# Altium project RF_V3.PrjPcb
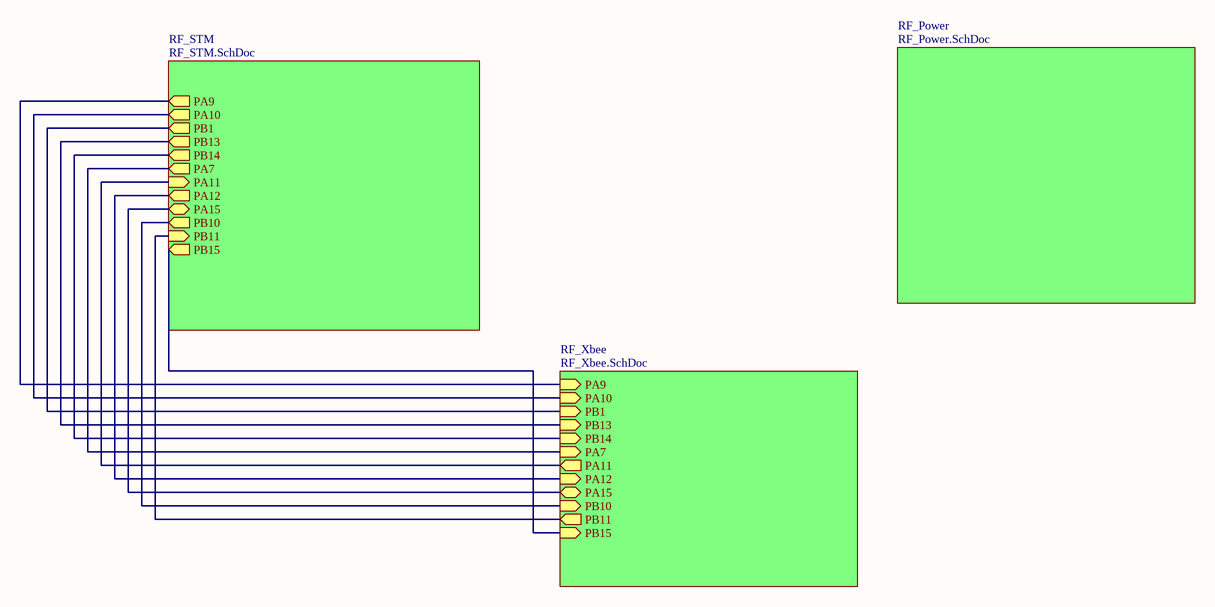
[diagram p0: RF_SCH.SchDoc]
4 sheets, 65 parts. Net scope: hierarchical (ports join the sheet entries above them; power ports are global).
Board files: RF_PCB-v2.PcbDoc, RF_PCB-v1.PcbDoc, RF_PCB.PcbDoc, RF_PCB1.PcbDoc
Sheets:
  RF_SCH.SchDoc
    RF_STM = RF_STM.SchDoc
    RF_Power = RF_Power.SchDoc
    RF_Xbee = RF_Xbee.SchDoc

## Sheet RF_SCH.SchDoc
size A4

### Sub-sheets
RF_Power = RF_Power.SchDoc: no entries
RF_STM = RF_STM.SchDoc: PA9 (out), PA10 (out), PB1 (out), PB13 (out), PB14 (out), PA7 (out), PA11 (in), PA12 (out), PA15 (bidir), PB10 (out), PB11 (in), PB15 (out)
RF_Xbee = RF_Xbee.SchDoc: PA9 (in), PA10 (in), PB1 (in), PB13 (in), PB14 (in), PA7 (in), PA11 (out), PA12 (in), PA15 (bidir), PB10 (in), PB11 (out), PB15 (in)

### Nets
Net1_3: sheet RF_STM/PA10, sheet RF_Xbee/PA10
Net1_4: sheet RF_STM/PA9, sheet RF_Xbee/PA9
Net1_6: sheet RF_STM/PB15, sheet RF_Xbee/PB15
Net1_7: sheet RF_STM/PB1, sheet RF_Xbee/PB1
Net1_10: sheet RF_STM/PB13, sheet RF_Xbee/PB13
Net1_29: sheet RF_STM/PB14, sheet RF_Xbee/PB14
NetC12_2: sheet RF_STM/PA7, sheet RF_Xbee/PA7
NetU3_29: sheet RF_STM/PB10, sheet RF_Xbee/PB10
NetU3_30: sheet RF_STM/PB11, sheet RF_Xbee/PB11
NetU3_44: sheet RF_STM/PA11, sheet RF_Xbee/PA11
NetU3_45: sheet RF_STM/PA12, sheet RF_Xbee/PA12
NetU3_50: sheet RF_STM/PA15, sheet RF_Xbee/PA15

## Sheet RF_STM.SchDoc
size A4
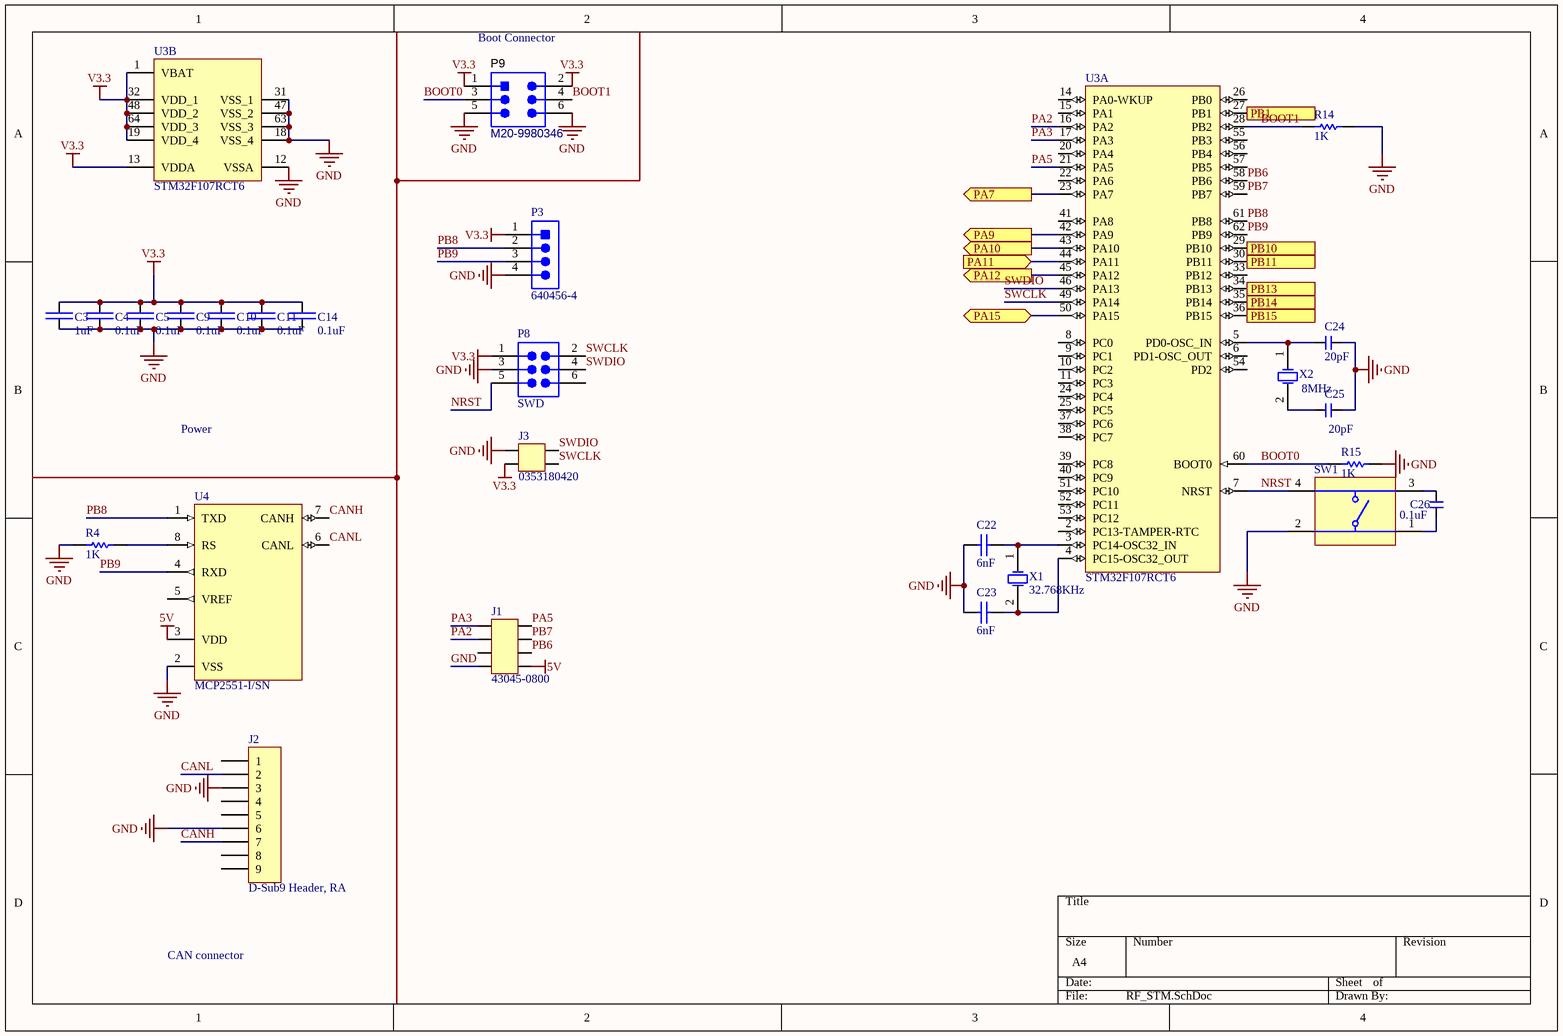
[diagram p1: RF_STM.SchDoc]

### Parts
C3  1uF  [C0805]
C4  0.1uF  [C0805]
C5  0.1uF  [C0805]
C9  0.1uF  [C0805]
C10  0.1uF  [C0805]
C11  0.1uF  [C0805]
C14  0.1uF  [C0805]
C22  6nF  [CAPC2013X140X50LL20T25]
C23  6nF  [CAPC2013X140X50LL20T25]
C24  20pF  [C0805]
C25  20pF  [C0805]
C26  0.1uF  [C0805]
J1  43045-0800  [Micro-Fit 3.0 8pos]
J2  D-Sub9 Header, RA  [D9 Connector]
J3  0353180420  [Mini-fit Jr. 4pos]
P3  640456-4  [TECO-640456-4]
P8  SWD  [SMTC-TSW-103-08-X-D]
P9  M20-9980346  [HRWN-M20-9980346_V]
R4  1K  [RESC1608X55X25ML10T15]
R14  1K  [RESC2013X50X30NL20T20]
R15  1K  [RESC2013X50X30NL20T20]
SW1  PTS645SM43SMTR92LFS  [ITT-PTS645S-4_V]  (value not drawn)
U3  STM32F107RCT6  [STM-LQFP64_M]  (parts A,B of 2)
U4  MCP2551-I/SN  [SOIC-SN8_N]
X1  32.768KHz  [ABRA-ABS07-2_V]
X2  8MHz  [ABRA-ABM3-2_V]

### Ports
PA7 (out), PA9 (out), PA10 (out), PA11 (in), PA12 (out), PA15 (bidir), PB1 (out), PB10 (out), PB11 (in), PB13 (out), PB14 (out), PB15 (out)

### Nets
5V: J1.4 U4.3(VDD)
GND: C3.2 C4.1 C5.1 C9.1 C10.2 C11.1 C14.1 C22.1 C23.1 C24.1 C25.1 J1.8 J2.3 J2.6 J3.1 P3.4 P8.3 P9.5 P9.6 R4.1 R14.1 R15.1 SW1.2 U3.12(VSSA) U3.18(VSS_4) U3.31(VSS_1) U3.47(VSS_2) U3.63(VSS_3) U4.2(VSS)
V3.3: C3.1 C4.2 C5.2 C9.2 C10.1 C11.2 C14.2 J3.3 P3.1 P8.1 P9.1 P9.2 U3.1(VBAT) U3.13(VDDA) U3.19(VDD_4) U3.32(VDD_1) U3.48(VDD_2) U3.64(VDD_3)
BOOT0: P9.3 R15.2 U3.60(BOOT0)
BOOT1: P9.4 R14.2 U3.28(PB2)
CANH: J2.7 U4.7(CANH)
CANL: J2.2 U4.6(CANL)
NRST: P8.5 SW1.4 U3.7(NRST)
PA2: J1.6 U3.16(PA2)
PA3: J1.5 U3.17(PA3)
PA5: J1.1 U3.21(PA5)
PB6: J1.3 U3.58(PB6)
PB7: J1.2 U3.59(PB7)
PB8: P3.2 U3.61(PB8) U4.1(TXD)
PB9: P3.3 U3.62(PB9) U4.4(RXD)
SWCLK: J3.4 P8.2 U3.49(PA14)
SWDIO: J3.2 P8.4 U3.46(PA13)
Net1_3: U3.43(PA10) ; port PA10
Net1_4: U3.42(PA9) ; port PA9
Net1_6: U3.36(PB15) ; port PB15
Net1_7: U3.27(PB1) ; port PB1
Net1_10: U3.34(PB13) ; port PB13
Net1_29: U3.35(PB14) ; port PB14
NetC12_2: U3.23(PA7) ; port PA7
NetC22_2: C22.2 U3.3(PC14-OSC32_IN) X1.1(X1)
NetC23_2: C23.2 U3.4(PC15-OSC32_OUT) X1.2(X2)
NetC24_2: C24.2 U3.5(PD0-OSC_IN) X2.1(X1)
NetC25_2: C25.2 X2.2(X2)
NetC26_1: C26.1 SW1.3
NetC26_2: C26.2 SW1.1
NetR4_2: R4.2 U4.8(RS)
NetU3_29: U3.29(PB10) ; port PB10
NetU3_30: U3.30(PB11) ; port PB11
NetU3_44: U3.44(PA11) ; port PA11
NetU3_45: U3.45(PA12) ; port PA12
NetU3_50: U3.50(PA15) ; port PA15

Not connected (* = marked no-connect by the designer): J1 7; J2 1 4 5 8 9; P8 6; U3 2(PC13-TAMPER-RTC) 6(PD1-OSC_OUT) 8(PC0) 9(PC1) 10(PC2) 11(PC3) 14(PA0-WKUP) 15(PA1) 20(PA4) 22(PA6) 24(PC4) 25(PC5) 26(PB0) 33(PB12) 37(PC6) 38(PC7) 39(PC8) 40(PC9) 41(PA8) 51(PC10) 52(PC11) 53(PC12) 54(PD2) 55(PB3) 56(PB4) 57(PB5); U4 5(VREF)

### Notes on the sheet
- (near P9) Boot Connector
- Power
- CAN connector

### Library data of the parts
C3 = CL21B105KAFNNNE: Cap Ceramic 1uF 25V X7R 10% SMD 0805 125C T/R; Manufacturer: Samsung; Supplier 1: Digi-Key; Supplier Part Number 1: 1276-1066-1-ND; Manufacturer Part Number: CL21B105KAFNNNE; Stock 1: 1606570; Pricing 1: 1 = 0.10000, 10 = 0.07600, 100 = 0.03380, 500 = 0.02416, 1000 = 0.01898 (USD); RoHS: Yes; Mount: Surface Mount; Case/Package: 0805; Contact Plating: Tin; Case Code (Metric): 2012; Case Code (Imperial): 0805; Min Operating Temperature: -55°C; Max Operating Temperature: 125°C; Packaging: Tape and Reel; Package Quantity: 1; Capacitance: 1uF; Tolerance: 10%; Voltage Rating: 25V; Dielectric: X7R; Voltage: 25V; Voltage Rating (DC): 25V; Length: 2mm; Height: 1.25mm; Depth: 1.25mm; Width: 0.049inch; Thickness: 0.053inch; Radiation Hardening: No; Lead Free: Lead Free; ComponentLink1URL: https://datasheet.ciiva.com/25800/cl21b105kafnnne-25800163.pdf?src-supplier=Digi-Key; ComponentLink1Description: https://datasheet.ciiva.com/25800/cl21b105kafnnne-25800163.pdf?src-supplier=Digi-Key; ComponentLink2URL: https://datasheet.ciiva.com/15195/getdatasheetpartid-355205-15195880.pdf?src-supplier=Verical; ComponentLink2Description: https://datasheet.ciiva.com/15195/getdatasheetpartid-355205-15195880.pdf?src-supplier=Verical; Category: Capacitors
C4 C5 C9-C11 C14 C26 = CL21B104KBCWPNC: CAP CER 0.1UF 50V X7R 0805; Manufacturer: Samsung; Capacitance: 100nF; Tolerance: 10%; Supplier 1: Digi-Key; Supplier Part Number 1: 1276-6557-1-ND; Manufacturer Part Number: CL21B104KBCWPNC; Stock 1: 6545; Pricing 1: 1 = 0.10000, 10 = 0.06700, 100 = 0.02990, 500 = 0.02138, 1000 = 0.01680 (USD); RoHS: Yes; Mount: Surface Mount; Case/Package: 0805; Case Code (Metric): 2012; Case Code (Imperial): 0805; Min Operating Temperature: -55°C; Max Operating Temperature: 125°C; Packaging: Tape and Reel; Voltage Rating: 50V; Features: Soft Termination; Length: 0.079inch; Width: 0.049inch; Thickness: 0.053inch; Ratings: AEC-Q200; Category: Capacitors
C22 C23 = CMP-2000-05810-1: Chip Capacitor, 2.2 uF, +/- 10%, 10 V, -55 to 85 degC, 0805 (2012 Metric), RoHS, Tape and Reel; Manufacturer: AVX; Dielectric: X5R; Rated Voltage: 10V; Capacitance: 2.2µF; Tolerance (%): ±10%; Datasheet Version: 05/2016; Manufacturer URL: http://www.avx.com/; Package Description: 2-Pin Surface Mount Device, Body 2.01 x 1.25 mm; Mounting Technology: SurfaceMount; Case Size/Dimension: 0805; Package Reference: 0805; Datasheet URL: http://datasheets.avx.com/cx5r.pdf
C24 C25 = C0805C200J5GACTU: CAP CER 20PF 50V C0G/NP0 0805; Manufacturer: Samsung; Manufacturer Part Number: CL21B103KBANNNC; Material: Ceramic; Capacitance: 10nF; Tolerance: 10%; Dielectric: X7R; Supplier 1: Digi-Key; Supplier Part Number 1: 399-8033-1-ND; RoHS: Yes; Mount: Surface Mount; Case/Package: 0805; Case Code (Metric): 2012; Case Code (Imperial): 0805; Contact Plating: Tin; Min Operating Temperature: -55°C; Max Operating Temperature: 125°C; Packaging: Tape and Reel; Voltage Rating: 50V; Voltage: 50V; Voltage Rating (DC): 50V; Length: 2mm; Height: 0.65mm; Width: 0.049inch; Thickness: 0.03inch; Depth: 1.25mm; Radiation Hardening: No; Lead Free: Lead Free; Category: Capacitors; ComponentLink1Description: https://www.digikey.com/product-detail/en/kemet/C0805C200J5GACTU/399-8033-1-ND/3471756; ComponentLink1URL: https://www.digikey.com/product-detail/en/kemet/C0805C200J5GACTU/399-8033-1-ND/3471756
J1 = 43045-0800: Micro-fit 3.0 8pos right-angle; Manufacturer: Molex; Number of Positions: 8; Contact Resistance: 10mR; Gender: Male; Working Voltage: 250V; Max Voltage Rating (DC): 250.25kV; Current Rating: 5A; Voltage Rating: 600V; Insulation Resistance: 1GR; Pitch: 3mm; Approvals: UL,CSA,TUV; Glow Wire Compliant: Compliant; Supplier 1: Digi-Key; Supplier Part Number 1: WM1816-ND; Manufacturer Part Number: 43045-0800; RoHS: Yes; Category: Headers and Wire Housings; Stock 1: 7880; Mount: Through Hole; Case/Package: SMC; Housing Color: Black; Housing Material: Thermoplastic; Contact Plating: Tin; Contact Material: Brass,Tin; Color: Black; Material: Polyester; Min Operating Temperature: -40°C; Max Operating Temperature: 105°C; Termination: Solder; Number of Contacts: 8; Orientation: Right Angle; Number of Rows: 2; Packaging: Tray; Number of Circuits: 8; Number of Poles: 8; Voltage Rating (AC): 250V; Package Quantity: 1440; Max Current Rating: 5A; Voltage Rating (DC): 250V; Diameter: 3mm; Length: 16.15mm; Height: 8.77mm; Row Spacing: 3mm; Depth: 12.2mm; Radiation Hardening: No; Flammability Rating: UL94 V-0; REACH SVHC: Unknown; Halogen Free: Low Halogen; Lead Free: Lead Free; ComponentLink1URL: https://datasheet.ciiva.com/5158/0430450800-pcb-headers-142625-5158817.pdf?src-supplier=Mouser; ComponentLink1Description: https://datasheet.ciiva.com/5158/0430450800-pcb-headers-142625-5158817.pdf?src-supplier=Mouser; ComponentLink2URL: https://datasheet.ciiva.com/7683/27645-7683683.pdf?src-supplier=Element14; ComponentLink2Description: https://datasheet.ciiva.com/7683/27645-7683683.pdf?src-supplier=Element14; ComponentLink3URL: https://datasheet.ciiva.com/11751/0900766b80027348-11751142.pdf?src-supplier=RSComponents; ComponentLink3Description: https://datasheet.ciiva.com/11751/0900766b80027348-11751142.pdf?src-supplier=RSComponents; ComponentLink4URL: https://datasheet.ciiva.com/30198/267770430450800-pcb-headers-30198875.pdf?src-supplier=Onlinecomponents.com; ComponentLink4Description: https://datasheet.ciiva.com/30198/267770430450800-pcb-headers-30198875.pdf?src-supplier=Onlinecomponents.com; ComponentLink5URL: https://datasheet.ciiva.com/19462/883536-19462164.pdf?src-supplier=Jameco; ComponentLink5Description: https://datasheet.ciiva.com/19462/883536-19462164.pdf?src-supplier=Jameco; ComponentLink6URL: https://datasheet.ciiva.com/14155/04402310-14155206.pdf?src-supplier=Distrelec; ComponentLink6Description: https://datasheet.ciiva.com/14155/04402310-14155206.pdf?src-supplier=Distrelec; ComponentLink7URL: https://datasheet.ciiva.com/16657/0430450800-pcb-headers-16657964.pdf?src-supplier=Avnet+Europe; ComponentLink7Description: https://datasheet.ciiva.com/16657/0430450800-pcb-headers-16657964.pdf?src-supplier=Avnet+Europe; ComponentLink8URL: https://datasheet.ciiva.com/10087/0430450800-pcb-headers-10087853.pdf?src-supplier=Avnet; ComponentLink8Description: https://datasheet.ciiva.com/10087/0430450800-pcb-headers-10087853.pdf?src-supplier=Avnet; ComponentLink9URL: https://datasheet.ciiva.com/1443/1850016-1443537.pdf?src-supplier=Element14; ComponentLink9Description: https://datasheet.ciiva.com/1443/1850016-1443537.pdf?src-supplier=Element14
J2 = 5747840-6: CONN D-SUB PLUG 9POS R/A SOLDER; Manufacturer: TE Connectivity; Body Material: Metal; Body Plating: Tin; Voltage Rating: 125V; Current Rating: 6A; Gender: Male; Number of Positions: 9; Number of Ports: 1; Mating Connector Lock: Yes (With); PCB Mount Retention: With; PCB Mounting Orientation: Right Angle; Preloaded: Yes; Sealable: No (Without); Pitch: 2.74mm; PCB Thickness: 1.57mm; Contact Post Length: 3.17mm; Hole Diameter: 0.125inch; Approvals: CSA,UL; Supplier 1: Digi-Key; Supplier Part Number 1: A32094-ND; Manufacturer Part Number: 5747840-6; Stock 1: 2830; Pricing 1: 1 = 4.13000, 10 = 3.96400, 25 = 3.63360, 50 = 3.46860, 130 = 3.30338, 260 = 2.89046, 520 = 2.80788, 1040 = 2.39496, 2600 = 2.22980 (USD); RoHS: Yes; Mount: Through Hole; Case/Package: Metal; Contact Material: Brass; Contact Plating: Gold,Nickel,Tin; Color: Black; Number of Terminals: 9; Material: Metal; Plating: Tin; Housing Material: Nylon; Contact Shape: Round; Housing Color: Black; Shell Material: Steel; Min Operating Temperature: -55°C; Max Operating Temperature: 105°C; Number of Rows: 2; Packaging: Tray; Package Quantity: 130; Connector Type: Plug; Termination: Solder; Number of Contacts: 9; Orientation: Right Angle; Mating Retention: Yes (With); PCB Mount Alignment: Yes (With); Length: 30.81mm; Height: 12.55mm; Width: 12.55mm; Depth: 18.62mm; Radiation Hardening: No; REACH SVHC: No SVHC; Flammability Rating: UL94 V-0; ComponentLink1URL: https://www.verical.com/server-webapp/html/getDatasheet?partID=46840&src-supplier=Verical; ComponentLink1Description: https://www.verical.com/server-webapp/html/getDatasheet?partID=46840&src-supplier=Verical; ComponentLink2URL: https://www.te.com/commerce/DocumentDelivery/DDEController?Action=srchrtrv&DocNm=82068_AMPLIMITE_Right-Angle_Posted_Conn&DocType=CS&DocLang=English&src-supplier=Digi-Key; ComponentLink2Description: https://www.te.com/commerce/DocumentDelivery/DDEController?Action=srchrtrv&DocNm=82068_AMPLIMITE_Right-Angle_Posted_Conn&DocType=CS&DocLang=English&src-supplier=Digi-Key; ComponentLink3URL: http://www.jameco.com/Jameco/Products/ProdDS/853231.pdf?src-supplier=Jameco; ComponentLink3Description: http://www.jameco.com/Jameco/Products/ProdDS/853231.pdf?src-supplier=Jameco; ComponentLink4URL: http://www.te.com/commerce/DocumentDelivery/DDEController?Action=srchrtrv&DocNm=82068_AMPLIMITE_Right-Angle_Posted_Conn&DocType=Catalog+Section&DocLang=English&src-supplier=Avnet+Europe; ComponentLink4Description: http://www.te.com/commerce/DocumentDelivery/DDEController?Action=srchrtrv&DocNm=82068_AMPLIMITE_Right-Angle_Posted_Conn&DocType=Catalog+Section&DocLang=English&src-supplier=Avnet+Europe; ComponentLink5URL: http://www.te.com/commerce/DocumentDelivery/DDEController?Action=srchrtrv&DocNm=82068_AMPLIMITE_Right-Angle_Posted_Conn&DocType=Catalog+Section&DocLang=English&src-supplier=Avnet; ComponentLink5Description: http://www.te.com/commerce/DocumentDelivery/DDEController?Action=srchrtrv&DocNm=82068_AMPLIMITE_Right-Angle_Posted_Conn&DocType=Catalog+Section&DocLang=English&src-supplier=Avnet; ComponentLink6URL: http://www.te.com/commerce/DocumentDelivery/DDEController?Action=srchrtrv&DocNm=82068_AMPLIMITE_Right-Angle_Posted_Conn&DocType=Catalog+Section&DocLang=English&PartCntxt=&src-supplier=Element14; ComponentLink6Description: http://www.te.com/commerce/DocumentDelivery/DDEController?Action=srchrtrv&DocNm=82068_AMPLIMITE_Right-Angle_Posted_Conn&DocType=Catalog+Section&DocLang=English&PartCntxt=&src-supplier=Element14; Category: Connectors
J3 = 0353180420: Conn Power HDR 4 POS 4.2mm Solder RA Thru-Hole 4 Terminal 1 Port Mini-Fit® Bag; Manufacturer: Molex; Number of Positions: 4; Number of Ports: 1; Connector Type: Male Pin; Row Spacing: 0.165inch; Supplier 1: Digi-Key; Supplier Part Number 1: WM13195-ND; Manufacturer Part Number: 0353180420; RoHS: Yes; Category: Headers and Wire Housings; Stock 1: 17776; Mount: Through Hole; Contact Material: Brass; Contact Plating: Tin; Housing Material: Nylon; Color: Natural; Number of Terminals: 4; Min Operating Temperature: -40°C; Max Operating Temperature: 105°C; Orientation: Right Angle; Number of Rows: 2; Packaging: Bulk; Termination: Solder; Number of Contacts: 4; Package Quantity: 5000; Fastening Type: Ramp; Length: 9.6mm; Pitch: 4.2mm; Contact Mating Length: 0.208inch; Depth: 12.8mm; ComponentLink1URL: https://datasheet.ciiva.com/6840/353180820-sd-6840231.pdf?src-supplier=Digi-Key; ComponentLink1Description: https://datasheet.ciiva.com/6840/353180820-sd-6840231.pdf?src-supplier=Digi-Key
P3 = CMP-2000-05419-1: Male Header, Pitch 2.54 mm, 1 x 4 Position, Height 10.03 mm, Tail Length 3.56 mm, RoHS, Bulk; Manufacturer: TE Connectivity; Material, Housing: Polyester; Primary Type: InterconnectSystem; Mount Angle: Vertical; Color, Housing: White; Current, Rating: 5 / A; Agency Approvals: CSA,UL; Contact Termination Area Plating: Tin; Temperature, Operating: -55to+105 / degC; Standards: RoHSCompliant,ELVCompliant,UL94V-0; Number of Positions: 4; Brand/Series: MTA-100Series; Angle: Straight; Pin Spacing: 0.1 / "; Material, Contact: CopperAlloy; Connector Type: MTA-100; Special Features: Pinstrip; Mounting Hole Size: 0.04 / "; Contact Centerline Spacing: 0.100 / in.; Voltage, Rating: 250 / V; Manufacturer URL: http://www.te.com/; Length, Pin: 0.14 / "; Length, Overall: 0.4 / "; Color: White; Flammability Rating: UL94V-0; Mounting Type: PCMount; Termination: Solder; Datasheet URL: https://datasheet.ciiva.com/16286/eng-ds-82056-mta-0608-16286228.pdf; Number of Contacts: 4; Contact Shape: Square; Contact Mating Area Plating: Tin; Length, Terminal Post: 0.14 / in.; Size, Post: 0.025 / in.; Contact Plating: Tin; Type: PCBPlug; Datasheet Version: Dec-14; Number of Rows: 1
P8 = CMP-1024-00338-1: 0.025" SQ Post Header, Through-hole, Vertical, -55 to 125 degC, 2.54 mm Pitch, 6-Pin, Male, RoHS; Manufacturer: Samtec; PartNumber: TSW-103-08-G-D; Pitch: 2.54 mm; ComponentLink1URL: http://www.samtec.com; ComponentLink2URL: http://www.samtec.com/documents/webfiles/pdf/TSW_TH.PDF; Temperature Range: -55 to 125 degC; RoHS: True; ComponentLink2Description: Datasheet; PackageReference: TSW-103-08-X-D; ComponentLink3Description: Package Specification; PackageDescription: .025[0.64] SQ. Post Terminal Strip Assembly; DatasheetVersion: F-214; Mounting Technology: Through-hole; ComponentLink1Description: Manufacturer URL; Orientation: Vertical; PackageVersion: DM, 8/1988; ComponentLink3URL: http://www.samtec.com/documents/webfiles/cpdf/TSW-XXX-XX-XXX-X-XX-XXX-MKT.pdf
P9 = CMP-2000-06636-1: Male Header, Pitch 2.54 mm, 2 x 3 Position, Height 8.64 mm, Tail Length 3 mm, -40 to 105 degC, RoHS, Bulk; Manufacturer: Harwin-Inc.; Row Spacing: 0.100"(2.54mm); Connector Type: Header,Unshrouded,Breakaway; Number of Positions Loaded: All; Number of Positions: 6; Datasheet Version: 12/2006; Mounting Technology: ThroughHole; Mounting Type: ThroughHole; Fastening Type: -; Contact Finish Thickness: -; Features: -; Series: M20; Package Reference: M20-9980346; Pitch: 0.100"(2.54mm); Contact Mating Length: 0.240"(6.10mm); Manufacturer URL: https://www.harwin.com/; Datasheet URL: https://datasheet.ciiva.com/26899/getdatasheetpartid-483857-26899433.pdf; Number of Rows: 2; Contact Type: MalePin; Termination: Solder; Contact Finish: Tin; Family: RectangularConnectors-Headers,MalePins; Color: Black; Package Description: Male Header, Pitch 2.54 mm, 2 x 3 Position, Height 8.64 mm, Tail Length 3 mm; Packaging: Bulk; Category: Connectors,Interconnects
R4 = CMP-2100-03664-1: Chip Resistor, 10 KOhm, +/- 1%, 01 W, -55 to 155 degC, 0603 (1608 Metric), RoHS, Tape and Reel; Manufacturer: Yageo; Temperature Coefficient: 100ppm/degreesC; Resistance: 10KOhm; Voltage Rating: 75V; Power Rating: 100mW; Voltage Rating (DC): 50V; Composition: ThickFilm; RoHSCompliant: true; Height: 0.45mm; Lead Free: LeadFree; Case Code (Metric): 1608; Case/Package: 0603; Datasheet Version: Rev. 5, 10/2016; Package Reference: 0603; Depth: 0.8mm; Package Description: 2-Pin Surface Mount Device, Body 1.6 x 0.8 mm; Case Code (Imperial): 0603; Packaging: TapeandReel; Termination: SMD/SMT; Lead Pitch: 0.3mm; Width: 0.8mm; Number of Pins: 2; Length: 1.6mm; REACH SVHC: NoSVHC; Military Standard: Not; Max Operating Temperature: 155degC; Min Operating Temperature: -55degC; Manufacturer URL: http://www.yageo.com/; Datasheet URL: http://www.yageo.com/NewPortal/yageodocoutput?fileName=/pdf/R-Chip/PYu-RC_Group_51_RoHS_L_5.pdf; Weight: 7.1E-05oz; Tolerance: 1%
R14 R15 = CMP-2001-03595-1: Part Number: CRCW08051K00FKEA; Manufacturer: Vishay Dale
SW1 = CMP-2000-05160-1: 6 mm Tact Switche, SPST, NO, -20 to 60 degC, 4-Pin SMT, RoHS, Tape and Reel; Manufacturer: ITT Cannon; Manufacturer URL: http://www.ittcannon.com/; Datasheet Version: Feb-14; Datasheet URL: https://datasheet.ciiva.com/29903/getdatasheetpartid-786341-29903846.pdf
U3 = CMP-0237-00079-3: ARM Cortex-M3 32-bit MCU, 256 KB Flash, 64 KB Internal RAM, 51 I/Os, 64-pin LQFP, -40 to 85 degC, Tray; FLASH Size (Prog) (kB): 256; Operating Frequency(F) (Processor speed) (MHz): 72; Supply Voltage(Vcc) min (V): 2; Internal RAM Size (kB): 64; A/D Converter: 2x12-bit (16 Channel); I/Os (High Current): 51; D/A Converter: 2x12-bit (2 Channel); Mounting Technology: Surface Mount; PartNumber: STM32F107RCT6; ComponentLink3URL: http://www.st.com/st-web-ui/static/active/en/resource/technical/document/datasheet/DM00037051.pdf; Packing: Tray; ComponentLink1URL: http://www.st.com/web/en/home.html; Core: ARM Cortex-M3; ComponentLink1Description: Manufacturer URL; ComponentLink2URL: http://www.st.com/st-web-ui/static/active/en/resource/technical/document/datasheet/CD00220364.pdf; DatasheetVersion: Rev. 6; PackageDescription: 64-Pin Low Profile Quad Flat Package, 10 x 10 mm Body, 0.5 mm Pitch; PackageVersion: Rev. 4, 06/2013; ComponentLink2Description: Datasheet; ComponentLink3Description: Package Specification; PackageReference: LQFP64
U4 = CMP-0186-00138-2: High-Speed CAN Transceiver, 8-Pin SOIC, Industrial Temperature; Code_JEDEC: MS-012; ComponentLink3URL: http://www.microchip.com/stellent/groups/techpub_sg/documents/packagingspec/en012702.pdf; DatasheetVersion: revF, Jul-2010; PackageVersion: revBB, Aug-2009; PackageDescription: 8-Lead Plastic Small Outline (SN) - Narrow, 3.90mm Body [SOIC]; ComponentLink1URL: http://www.microchip.com/; ComponentLink3Description: Package Specification; ComponentLink2Description: Datasheet; Code_IPC: SOIC127P600-8; ComponentLink1Description: Manufacturer URL; PackageReference: SOIC-SN8; ComponentLink2URL: http://ww1.microchip.com/downloads/en/DeviceDoc/21667F.pdf; RevisionNote: URLs added. DatasheetVersion updated.
X1 = CMP-0447-00001-2: Crystal, 32.768 kHz, 12.5 pF, -40 to 85 degC, SMD Low Profile 3.2 x 1.5 x 0.9 mm, Tape and Reel; Manufacturer: Abracon; PartNumber: ABS07-32.768KHz-T; Q Value (Type): 30000; Operation Mode: Flexural Mode (Tuning Fork); Shunt Capacitance (C0): 0.9 to 1.2 pF; Load Capacitance (CL): 12.5 pF; Frequency Tolerance @+25degC: +/- 20 ppm; Drive Level (Type): 0.1 uW; Equivalent Series Resistance (R1): 70 Kohm; Insulation Resistance (Min): 500 Mohm; ComponentLink3URL: http://www.abracon.com/Resonators/ABS07.pdf; PackageDescription: 2-Pin Hand Drawn, Body 3.2x1.5mm, Pitch 2.5mm; Operating Temperature: -40 to 85 degC; ComponentLink2URL: http://www.abracon.com/Resonators/ABS07.pdf; PackageReference: ABS07-2; ComponentLink3Description: Package Specification; ComponentLink1Description: Manufacturer URL; DatasheetVersion: 04.03.13; Mounting Technology: Surface Mount; ComponentLink2Description: Datasheet; ComponentLink1URL: http://www.abracon.com/; Packing: Tape and Reel; Frequency: 32.768 kHz
X2 = CMP-2000-05033-1: Miniature Ceramic Crystal, 8 MHz, -40 to 85 degC, 2-Pin SMD, RoHS, Tape and Reel; Manufacturer: ABRACON; Case Length: 5mm; Case Width: 3.2mm; Case Height: 1.3mm; Load Capacitance: 18pF; Frequency Stability: 30PPM; ESR: 140Ohms; Tolerance: 20PPM; Type: MiniatureCeramicCrystal; Factory Pack Quantity: 1000; Package / Case: 5mmx3.2mm; Mounting Style: SMD/SMT; Manufacturer URL: http://www.abracon.com/; RoHS: Details; Frequency: 8MHz; Dimensions: 3.2mmWx5mmLx1.3mmH; Datasheet URL: http://www.farnell.com/datasheets/1754353.pdf; Brand: ABRACON; Packaging: Reel; Product Category: Crystals; Package Description: 2-Pin Surface Mount Device, Body 5 x 3.2 mm; Package URL: http://www.abracon.com/Support/PackageDrawing/Resonators/ABM3.PDF; Operating Temperature Range: -40Cto+85C; Termination Style: SMD/SMT; Datasheet Version: Sep-13; Series: ABM3; Package Reference: ABM3-2

## Sheet RF_Power.SchDoc
size A4
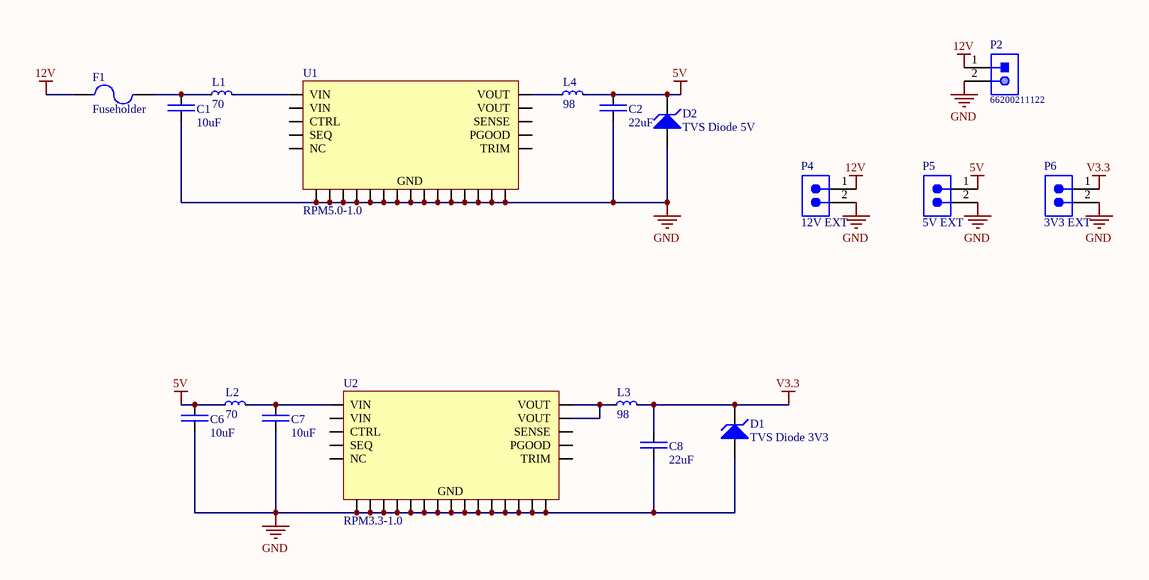
[diagram p2: RF_Power.SchDoc]

### Parts
C1  10uF  [1206]
C2  22uF  [1206]
C6  10uF  [1206]
C7  10uF  [1206]
C8  22uF  [1206]
D1  TVS Diode 3V3  [SOD-323]
D2  TVS Diode 5V  [SOD-323]
F1  Fuseholder  [SCHURTER - 0031.7701.11 - FUSE HOLDER, PCB MOUNT]
L1  70  [1812]
L2  70  [1812]
L3  98  [7427932]
L4  98  [7427932]
P2  66200211122  [66200211122]
P4  12V EXT  [SMTC-TSW-102-26-XX-S]
P5  5V EXT  [SMTC-TSW-102-26-XX-S]
P6  3V3 EXT  [SMTC-TSW-102-26-XX-S]
U1  RPM5.0-1.0  [25-BLGA]
U2  RPM3.3-1.0  [25-BLGA]

### Nets
5V: C2.2 C6.1 D2.2(K) L2.1 L4.2 P5.1
12V: F1.1 P2.1 P4.1
GND: C1.2 C2.1 C6.2 C7.1 C8.1 D1.1(A) D2.1(A) P2.2 P4.2 P5.2 P6.2 U1.A3(GND) U1.A4(GND) U1.B1(GND) U1.B2(GND) U1.B3(GND) U1.B4(GND) U1.C2(GND) U1.C3(GND) U1.C4(GND) U1.D2(GND) U1.D3(GND) U1.D4(GND) U1.D5(GND) U1.E3(GND) U1.E4(GND) U2.A3(GND) U2.A4(GND) U2.B1(GND) U2.B2(GND) U2.B3(GND) U2.B4(GND) U2.C2(GND) U2.C3(GND) U2.C4(GND) U2.D2(GND) U2.D3(GND) U2.D4(GND) U2.D5(GND) U2.E3(GND) U2.E4(GND)
V3.3: C8.2 D1.2(K) L3.2 P6.1
NetC1_1: C1.1 F1.2 L1.1
NetC7_2: C7.2 L2.2 U2.A1(VIN)
NetL1_2: L1.2 U1.A1(VIN)
NetL3_1: L3.1 U2.A5(VOUT) U2.B5(VOUT)
NetL4_1: L4.1 U1.A5(VOUT)

Not connected (* = marked no-connect by the designer): U1 A2(VIN) B5(VOUT) C1(CTRL) C5(SENSE) D1(PGOOD) E1(SEQ) E2(NC) E5(TRIM); U2 A2(VIN) C1(CTRL) C5(SENSE) D1(PGOOD) E1(SEQ) E2(NC) E5(TRIM)

### Library data of the parts
C1 C6 C7 = CL31B106KAHNFNE: CAP CER 10UF 25V X7R 1206; Manufacturer: Samsung; Tolerance: 10%; Supplier 1: Digi-Key; Supplier Part Number 1: 1276-3100-1-ND; Manufacturer Part Number: CL31B106KAHNFNE; RoHS: Yes; Category: Ceramic Capacitors; Stock 1: 1201; Mount: Surface Mount; Case/Package: 1206; Case Code (Metric): 3216; Case Code (Imperial): 1206; Min Operating Temperature: -55°C; Max Operating Temperature: 125°C; Package Quantity: 1; Packaging: Tape and Reel; Capacitance: 10uF; Voltage Rating: 25V; Dielectric: X7R; Length: 3.2mm; Height: 1.6mm; Width: 0.063inch; Thickness: 0.071inch; Depth: 1.6mm; Radiation Hardening: No; Lead Free: Lead Free; ComponentLink1URL: https://datasheet.ciiva.com/25795/cl31b106kahnfne-25795136.pdf?src-supplier=Digi-Key; ComponentLink1Description: https://datasheet.ciiva.com/25795/cl31b106kahnfne-25795136.pdf?src-supplier=Digi-Key
C2 C8 = CL31B226KPHNNNE: CAP CER 22UF 10V X7R 1206; Manufacturer: Samsung; Tolerance: 10%; Supplier 1: Digi-Key; Supplier Part Number 1: 1276-2769-1-ND; Manufacturer Part Number: CL31B226KPHNNNE; RoHS: Yes; Category: Ceramic Capacitors; Stock 1: 617814; Mount: Surface Mount; Case/Package: 1206; Case Code (Metric): 3216; Case Code (Imperial): 1206; Contact Plating: Tin; Min Operating Temperature: -55°C; Max Operating Temperature: 125°C; Package Quantity: 2000; Packaging: Tape and Reel; Capacitance: 22uF; Voltage Rating: 10V; Dielectric: X7R; Voltage Rating (DC): 10V; Termination: Wraparound; Length: 3.2mm; Thickness: 0.071inch; Width: 0.063inch; Depth: 1.6mm; Radiation Hardening: No; Lead Free: Lead Free; ComponentLink1URL: https://datasheet.ciiva.com/25724/cl31b226kphnnne-25724443.pdf?src-supplier=Digi-Key; ComponentLink1Description: https://datasheet.ciiva.com/25724/cl31b226kphnnne-25724443.pdf?src-supplier=Digi-Key; ComponentLink2URL: https://datasheet.ciiva.com/16384/cl31b226kphnnne-16384588.pdf?src-supplier=Future+Electronics; ComponentLink2Description: https://datasheet.ciiva.com/16384/cl31b226kphnnne-16384588.pdf?src-supplier=Future+Electronics; ComponentLink3URL: https://datasheet.ciiva.com/26838/getdatasheetpartid-710483-26838941.pdf?src-supplier=Verical; ComponentLink3Description: https://datasheet.ciiva.com/26838/getdatasheetpartid-710483-26838941.pdf?src-supplier=Verical
D1 = CDSOD323-T03S: ESD Suppressor TVS ±30kV 2-Pin SOD-323 T/R; Manufacturer: Bourns; Direction: Unidirectional; Operating Supply Voltage: 3.3V; Max Surge Current: 43A; Capacitance: 500pF; Number of Unidirectional Channels: 1; Min Breakdown Voltage: 4V; Clamping Voltage: 10.9V; Peak Pulse Power: 500W; Power Line Protection: No; Leakage Current: 125uA; Element Configuration: Single; Supplier 1: Digi-Key; Supplier Part Number 1: CDSOD323-T03SCT-ND; Manufacturer Part Number: CDSOD323-T03S; Stock 1: 99362; Pricing 1: 1 = 0.72000, 10 = 0.60600, 25 = 0.53000, 100 = 0.45420, 250 = 0.39368, 500 = 0.33310, 1000 = 0.25740 (USD); RoHS: Yes; Mount: Surface Mount; Case/Package: SOD-323-2; Number of Pins: 2; Contact Plating: Tin; Min Operating Temperature: -55°C; Max Operating Temperature: 150°C; Packaging: Tape and Reel; Package Quantity: 3000; Reverse Standoff Voltage: 3.3V; Polarity: Unidirectional; Number of Channels: 1; Breakdown Voltage: 4V; Termination: SMD/SMT; Working Voltage: 3.3V; Max Power Dissipation: 500W; Peak Pulse Current: 43A; Composition: Zener; Length: 1.9mm; Depth: 1.45mm; Radiation Hardening: No; REACH SVHC: No SVHC; ComponentLink1URL: https://datasheet.ciiva.com/22685/1671000-22685541.pdf?src-supplier=Element14; ComponentLink1Description: https://datasheet.ciiva.com/22685/1671000-22685541.pdf?src-supplier=Element14; ComponentLink2URL: https://datasheet.ciiva.com/6575/cdsod323-txxsc-6575941.pdf?src-supplier=Digi-Key; ComponentLink2Description: https://datasheet.ciiva.com/6575/cdsod323-txxsc-6575941.pdf?src-supplier=Digi-Key; ComponentLink3URL: https://datasheet.ciiva.com/11193/cdsod323-txxsc-11193742.pdf?src-supplier=Avnet; ComponentLink3Description: https://datasheet.ciiva.com/11193/cdsod323-txxsc-11193742.pdf?src-supplier=Avnet; Category: Circuit Protection
D2 = SD05T1G: TVS DIODE 5V 9.8V SOD323; Manufacturer: ON Semiconductor; Capacitance: 350pF; Direction: Unidirectional; Clamping Voltage: 14.5V; Peak Pulse Power: 350W; Number of Unidirectional Channels: 1; Min Breakdown Voltage: 6.2V; Power Line Protection: No; Peak Pulse Current: 24A; Element Configuration: Single; Breakdown Voltage: 6.75V; Leakage Current: 10uA; Max Breakdown Voltage: 7.3V; Test Current: 1mA; ESD Protection: Yes; Max Power Dissipation: 200mW; Supplier 1: Digi-Key; Supplier Part Number 1: SD05T1GOSCT-ND; Manufacturer Part Number: SD05T1G; Stock 1: 61559; Pricing 1: 1 = 0.49000, 10 = 0.36500, 100 = 0.20680, 500 = 0.13698, 1000 = 0.10502 (USD); RoHS: Yes; Case/Package: SOD-323-2; Number of Pins: 2; Contact Plating: Tin; Min Operating Temperature: -55°C; Max Operating Temperature: 150°C; Packaging: Tape and Reel; Reverse Standoff Voltage: 5V; Working Voltage: 5V; Composition: Zener; Package Quantity: 1; Operating Supply Voltage: 5V; Max Surge Current: 24A; Number of Elements: 1; Reverse Breakdown Voltage: 6.2V; Polarity: Unidirectional; Termination: SMD/SMT; Power Dissipation: 350W; Max Reverse Leakage Current: 10uA; Voltage Rating (DC): 5V; Max Output Current: 24A; Length: 1.7mm; Height: 1mm; Width: 1.35mm; Depth: 1.25mm; Radiation Hardening: No; Lead Free: Lead Free; REACH SVHC: No SVHC; ComponentLink1URL: https://datasheet.ciiva.com/4507/sd05t1-d-241634-4507873.pdf?src-supplier=Mouser; ComponentLink1Description: https://datasheet.ciiva.com/4507/sd05t1-d-241634-4507873.pdf?src-supplier=Mouser; ComponentLink2URL: https://datasheet.ciiva.com/16200/sd05t1-d-16200994.pdf?src-supplier=Future+Electronics; ComponentLink2Description: https://datasheet.ciiva.com/16200/sd05t1-d-16200994.pdf?src-supplier=Future+Electronics; ComponentLink3URL: https://datasheet.ciiva.com/15143/getdatasheetpartid-117154-15143559.pdf?src-supplier=Verical; ComponentLink3Description: https://datasheet.ciiva.com/15143/getdatasheetpartid-117154-15143559.pdf?src-supplier=Verical; ComponentLink4URL: https://datasheet.ciiva.com/30478/0900766b81250bd7-30478714.pdf?src-supplier=RSComponents; ComponentLink4Description: https://datasheet.ciiva.com/30478/0900766b81250bd7-30478714.pdf?src-supplier=RSComponents; ComponentLink5URL: https://datasheet.ciiva.com/339/sd05t1-d-339830.pdf?src-supplier=Digi-Key; ComponentLink5Description: https://datasheet.ciiva.com/339/sd05t1-d-339830.pdf?src-supplier=Digi-Key; ComponentLink6URL: https://datasheet.ciiva.com/339/sd05t1-d-339831.pdf?src-supplier=Digi-Key; ComponentLink6Description: https://datasheet.ciiva.com/339/sd05t1-d-339831.pdf?src-supplier=Digi-Key; ComponentLink7URL: https://datasheet.ciiva.com/11193/sd05t1-d-11193467.pdf?src-supplier=Avnet; ComponentLink7Description: https://datasheet.ciiva.com/11193/sd05t1-d-11193467.pdf?src-supplier=Avnet; ComponentLink8URL: https://datasheet.ciiva.com/22637/1878253-22637228.pdf?src-supplier=Element14; ComponentLink8Description: https://datasheet.ciiva.com/22637/1878253-22637228.pdf?src-supplier=Element14; ComponentLink9URL: https://datasheet.ciiva.com/25956/sd05t1-d-25956638.pdf?src-supplier=Avnet+Europe; ComponentLink9Description: https://datasheet.ciiva.com/25956/sd05t1-d-25956638.pdf?src-supplier=Avnet+Europe; Category: Circuit Protection
F1 = 0031.7701.11: SCHURTER - 0031.7701.11 - FUSE HOLDER, PCB MOUNT; Color: White; Material: Tin; Body Material: Thermoplastic; Current Rating: 5A; Voltage Rating (AC): 125V; Number of Poles: 1; Illumination Type: Illuminated; Supplier 1: Digi-Key; Supplier Part Number 1: 486-1991-ND; Manufacturer: Schurter; Manufacturer Part Number: 0031.7701.11; Stock 1: 11381; Pricing 1: 1 = 1.39000, 50 = 1.03400, 100 = 0.93100, 500 = 0.70300, 1000 = 0.52080 (USD); RoHS: Yes; Mount: Surface Mount; Weight: 0.016932oz; Contact Material: Copper Alloy; Contact Plating: Tin; Terminal Material: Brass; Min Operating Temperature: -40°C; Max Operating Temperature: 85°C; Package Quantity: 100; Packaging: Bulk; Voltage Rating: 125V; Number of Circuits: 1; Termination: SMD/SMT; Voltage: 125V; Fuse Current: 5A; Voltage Rating (DC): 125V; Length: 12mm; Height: 6mm; Width: 5.2mm; Depth: 5.2mm; Radiation Hardening: No; REACH SVHC: No SVHC; Lead Free: Lead Free; ComponentLink1URL: https://datasheet.ciiva.com/1270/typ-omh-125-1270896.pdf?src-supplier=Element14; ComponentLink1Description: https://datasheet.ciiva.com/1270/typ-omh-125-1270896.pdf?src-supplier=Element14; ComponentLink2URL: https://datasheet.ciiva.com/7496/typ-omh-125-7496724.pdf?src-supplier=Digi-Key; ComponentLink2Description: https://datasheet.ciiva.com/7496/typ-omh-125-7496724.pdf?src-supplier=Digi-Key; ComponentLink3URL: https://datasheet.ciiva.com/16215/typ-omh-125-16215096.pdf?src-supplier=Onlinecomponents.com; ComponentLink3Description: https://datasheet.ciiva.com/16215/typ-omh-125-16215096.pdf?src-supplier=Onlinecomponents.com; ComponentLink4URL: https://datasheet.ciiva.com/30058/73typ-omh-125-30058618.pdf?src-supplier=Onlinecomponents.com; ComponentLink4Description: https://datasheet.ciiva.com/30058/73typ-omh-125-30058618.pdf?src-supplier=Onlinecomponents.com; ComponentLink5URL: https://datasheet.ciiva.com/14128/awomh125-data-e-14128364.pdf?src-supplier=Distrelec; ComponentLink5Description: https://datasheet.ciiva.com/14128/awomh125-data-e-14128364.pdf?src-supplier=Distrelec; ComponentLink6URL: https://datasheet.ciiva.com/1221/1925349-1221826.pdf?src-supplier=Newark; ComponentLink6Description: https://datasheet.ciiva.com/1221/1925349-1221826.pdf?src-supplier=Newark; ComponentLink7URL: https://datasheet.ciiva.com/3014/typ-omh-125-3014522.pdf?src-supplier=Avnet; ComponentLink7Description: https://datasheet.ciiva.com/3014/typ-omh-125-3014522.pdf?src-supplier=Avnet; ComponentLink8URL: https://datasheet.ciiva.com/4480/typ-omh-125-4480427.pdf?src-supplier=Mouser; ComponentLink8Description: https://datasheet.ciiva.com/4480/typ-omh-125-4480427.pdf?src-supplier=Mouser; ComponentLink9URL: https://datasheet.ciiva.com/17405/typ-omh-125-17405484.pdf?src-supplier=Avnet+Europe; ComponentLink9Description: https://datasheet.ciiva.com/17405/typ-omh-125-17405484.pdf?src-supplier=Avnet+Europe; Category: Circuit Protection; ComponentLink10Description: Digikey; ComponentLink10URL: https://www.digikey.ca/product-detail/en/schurter-inc/0031.7701.11/486-1991-ND/640027
L1 L2 = 742792510: WURTH ELEKTRONIK - 742792510 - FERRITE BEAD, 70R, 6A, 1812; Manufacturer: Wurth Electronics; Max DC Current: 3mA; DC Resistance (DCR): 30mR; Test Frequency: 100MHz; Number of Lines: 1; Tolerance: 25%; Supplier 1: Digi-Key; Supplier Part Number 1: 732-1640-1-ND; Manufacturer Part Number: 742792510; RoHS: Yes; Category: Ferrite Beads and Chips; Stock 1: 5974; Mount: Surface Mount; Case/Package: SMD/SMT; Weight: 0.003951oz; Case Code (Imperial): 1812; Case Code (Metric): 4532; Material: Ferrite; Min Operating Temperature: -55°C; Max Operating Temperature: 125°C; Max Current Rating: 6A; Termination: SMD/SMT; Package Quantity: 1; Packaging: Tape and Reel; Current Rating: 6A; Impedance: 70R; Resistance: 30mR; Length: 4.5mm; Height: 1.5mm; Depth: 3.2mm; Width: 3.2mm; Lead Free: Lead Free; REACH SVHC: Unknown; ComponentLink1URL: https://datasheet.ciiva.com/1475/1695992-1475250.pdf?src-supplier=Farnell; ComponentLink1Description: https://datasheet.ciiva.com/1475/1695992-1475250.pdf?src-supplier=Farnell; ComponentLink2URL: https://datasheet.ciiva.com/11803/0900766b80bbd134-11803157.pdf?src-supplier=RSComponents; ComponentLink2Description: https://datasheet.ciiva.com/11803/0900766b80bbd134-11803157.pdf?src-supplier=RSComponents; ComponentLink3URL: https://datasheet.ciiva.com/23762/742792510-23762981.pdf?src-supplier=Newark; ComponentLink3Description: https://datasheet.ciiva.com/23762/742792510-23762981.pdf?src-supplier=Newark; ComponentLink4URL: https://datasheet.ciiva.com/4940/742792510-72179-4940456.pdf?src-supplier=Mouser; ComponentLink4Description: https://datasheet.ciiva.com/4940/742792510-72179-4940456.pdf?src-supplier=Mouser; ComponentLink5URL: https://datasheet.ciiva.com/1013/742792510-1013644.pdf?src-supplier=Digi-Key; ComponentLink5Description: https://datasheet.ciiva.com/1013/742792510-1013644.pdf?src-supplier=Digi-Key; ComponentLink6URL: https://datasheet.ciiva.com/1013/742792510-1013645.pdf?src-supplier=Digi-Key; ComponentLink6Description: https://datasheet.ciiva.com/1013/742792510-1013645.pdf?src-supplier=Digi-Key; ComponentLink7URL: https://datasheet.ciiva.com/1126/1695992-1126824.pdf?src-supplier=Element14; ComponentLink7Description: https://datasheet.ciiva.com/1126/1695992-1126824.pdf?src-supplier=Element14; ComponentLink8URL: https://datasheet.ciiva.com/1013/742792510-1013646.pdf?src-supplier=Digi-Key; ComponentLink8Description: https://datasheet.ciiva.com/1013/742792510-1013646.pdf?src-supplier=Digi-Key
L3 L4 = 7427932: Ferrite Bead 98 Ohm 2SMD 1LN; Manufacturer: Wurth Electronics; DC Resistance (DCR): 0.9mR; Max DC Current: 6A; Tolerance: 25%; Shielding: Unshielded; Number of Lines: 1; Test Frequency: 100MHz; Impedance: 98R; Supplier 1: Digi-Key; Supplier Part Number 1: 732-2394-1-ND; Manufacturer Part Number: 7427932; RoHS: Yes; Category: Ferrite Beads and Chips; Stock 1: 698; Mount: Surface Mount; Case/Package: SMD/SMT; Case Code (Metric): 4532; Case Code (Imperial): 1812; Min Operating Temperature: -55°C; Max Operating Temperature: 125°C; Termination: SMD/SMT; Package Quantity: 1; Packaging: Tape and Reel; Max Current Rating: 6A; Length: 7.8mm; Height: 3mm; Depth: 4.75mm; Width: 0.187inch; REACH SVHC: Unknown; ComponentLink1URL: https://datasheet.ciiva.com/1014/7427932-1014097.pdf?src-supplier=Digi-Key; ComponentLink1Description: https://datasheet.ciiva.com/1014/7427932-1014097.pdf?src-supplier=Digi-Key; ComponentLink2URL: https://datasheet.ciiva.com/1466/1696119-1466626.pdf?src-supplier=Element14; ComponentLink2Description: https://datasheet.ciiva.com/1466/1696119-1466626.pdf?src-supplier=Element14; ComponentLink3URL: https://datasheet.ciiva.com/11796/0900766b80f886b0-11796146.pdf?src-supplier=RSComponents; ComponentLink3Description: https://datasheet.ciiva.com/11796/0900766b80f886b0-11796146.pdf?src-supplier=RSComponents; ComponentLink4URL: https://datasheet.ciiva.com/23763/7427932-23763047.pdf?src-supplier=Newark; ComponentLink4Description: https://datasheet.ciiva.com/23763/7427932-23763047.pdf?src-supplier=Newark; ComponentLink5URL: https://datasheet.ciiva.com/4939/7427932-72413-4939403.pdf?src-supplier=Mouser; ComponentLink5Description: https://datasheet.ciiva.com/4939/7427932-72413-4939403.pdf?src-supplier=Mouser; ComponentLink6URL: https://datasheet.ciiva.com/1014/7427932-1014098.pdf?src-supplier=Digi-Key; ComponentLink6Description: https://datasheet.ciiva.com/1014/7427932-1014098.pdf?src-supplier=Digi-Key; ComponentLink7URL: https://datasheet.ciiva.com/1014/7427932-1014099.pdf?src-supplier=Digi-Key; ComponentLink7Description: https://datasheet.ciiva.com/1014/7427932-1014099.pdf?src-supplier=Digi-Key; ComponentLink8URL: https://datasheet.ciiva.com/22711/1696119-22711445.pdf?src-supplier=Element14; ComponentLink8Description: https://datasheet.ciiva.com/22711/1696119-22711445.pdf?src-supplier=Element14
P2 = CMP-1502-00440-1: THT Male Header WR-MPC3, Vertical, Single Row, pitch 3 mm, 2 pins; Manufacturer: Wurth Elektronik; Contact Resistance: 10mOhm; Pin Number: 2; Working Voltage: 250VAC; Pitch: 3mm; Orientation: Vertical; Mounting Technology: THT; Packaging: Tube; Publisher: WurthElektronik; Operating Temperature: -40to105degC; Datasheet URL: https://katalog.we-online.de/em/datasheet/6620xx11122.pdf; Manufacturer URL: http://www.we-online.de; Part Number: 66200211122; Gender: Male; Package Reference: 66200211122
P4-P6 = CMP-1024-00327-1: 0.025" SQ Post Header, Through-hole, Vertical, -55 to 125 degC, 2.54 mm Pitch, 2-Pin, Male, RoHS; PartNumber: TSW-102-26-G-S; Manufacturer: Samtec; Pitch: 2.54 mm; Orientation: Vertical; ComponentLink3Description: Package Specification; PackageReference: TSW-102-26-XX-S; Mounting Technology: Through-hole; ComponentLink2Description: Datasheet; ComponentLink1URL: http://www.samtec.com; DatasheetVersion: F-214; ComponentLink1Description: Manufacturer URL; RoHS: True; ComponentLink2URL: http://www.samtec.com/documents/webfiles/pdf/TSW_TH.PDF; ComponentLink3URL: http://www.samtec.com/documents/webfiles/cpdf/TSW-XXX-XX-XXX-X-XX-XXX-MKT.pdf; PackageDescription: .025[0.64] SQ. Post Terminal Strip Assembly; PackageVersion: DM, 8/1988; Temperature Range: -55 to 125 degC
U1 = RPM5.0-1.0: 1A DC/DC-CONVERTER INNOLINE SM; Manufacturer: Recom; Supplier 1: Digi-Key; Supplier Part Number 1: 945-3250-1-ND; Manufacturer Part Number: RPM5.0-1.0; RoHS: No; Stock 1: 175; ComponentLink1URL: https://www.recom-power.com/pdf/Innoline/RPM-1.0.pdf?src-supplier=Digi-Key; ComponentLink1Description: https://www.recom-power.com/pdf/Innoline/RPM-1.0.pdf?src-supplier=Digi-Key
U2 = RPM3.3-1.0: 1A DC/DC-CONVERTER INNOLINE SM; Manufacturer: Recom; Supplier 1: Digi-Key; Supplier Part Number 1: 945-3249-1-ND; Manufacturer Part Number: RPM3.3-1.0; RoHS: No; Stock 1: 319; ComponentLink1URL: https://www.recom-power.com/pdf/Innoline/RPM-1.0.pdf?src-supplier=Digi-Key; ComponentLink1Description: https://www.recom-power.com/pdf/Innoline/RPM-1.0.pdf?src-supplier=Digi-Key

## Sheet RF_Xbee.SchDoc
size A4
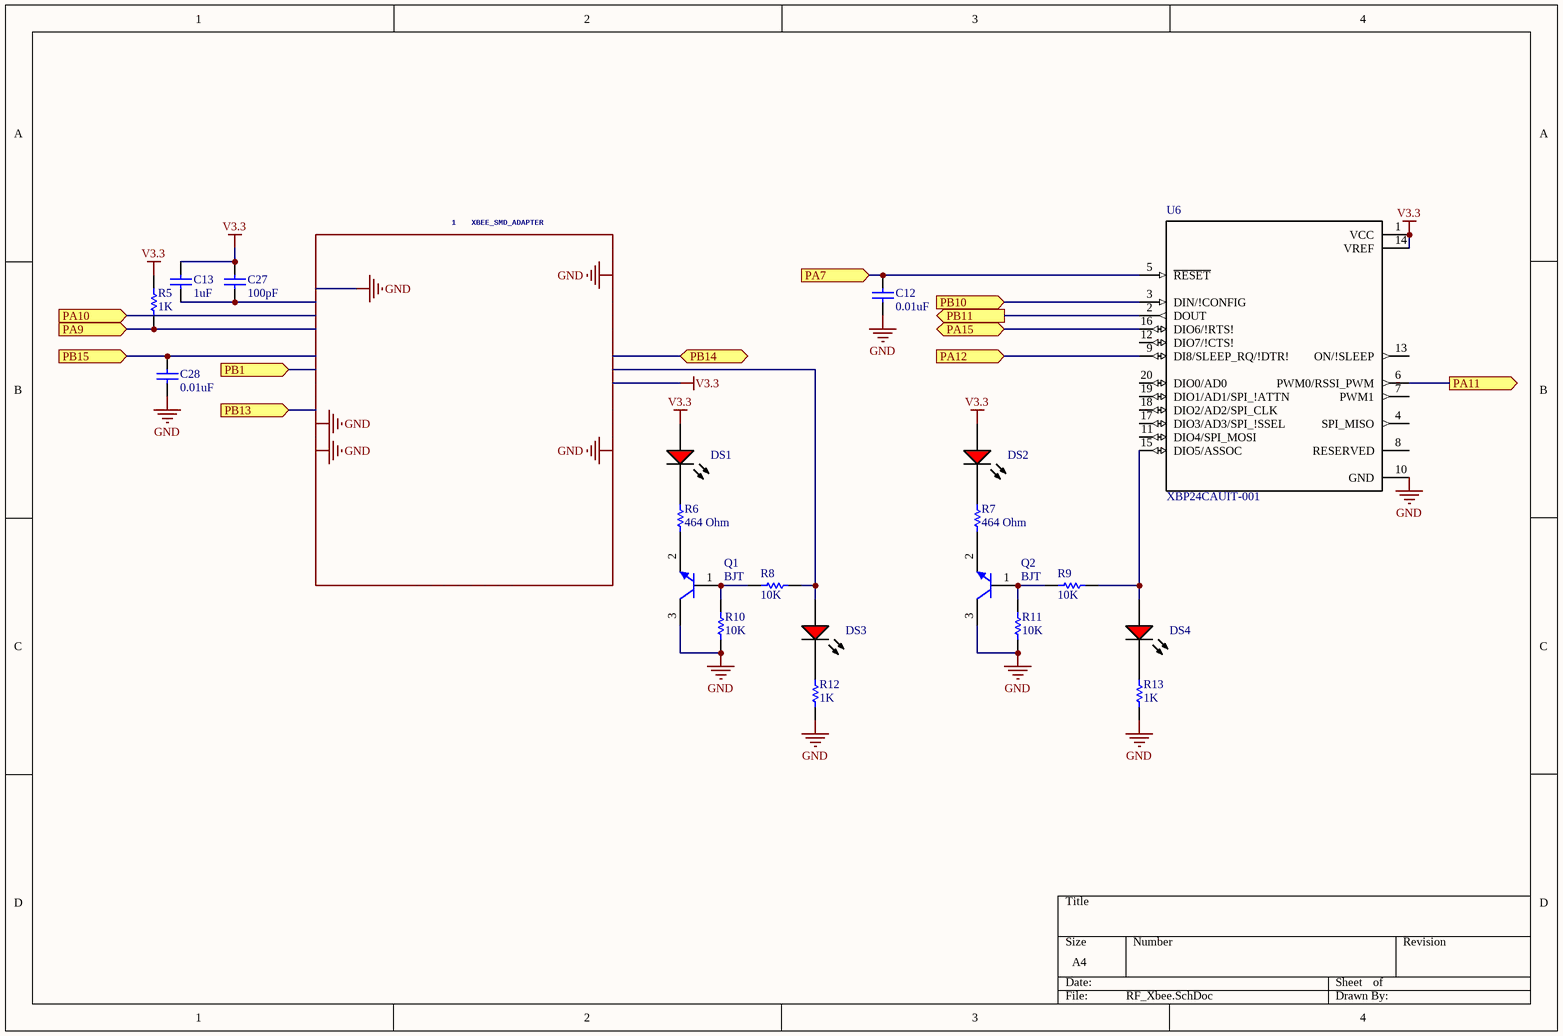
[diagram p3: RF_Xbee.SchDoc]

### Parts
1  XBEE_SMD_ADAPTER  [XBEE_SMD_ADAPTER]
C12  0.01uF  [CAPC1206(3216)170_M]
C13  1uF  [CAPC3216X180X50ML20T25]
C27  100pF  [CAPC2013X88X50ML20T25]
C28  0.01uF  [CAPC1206(3216)170_M]
DS1  HSMH-C150  [AVAG-HSMX-C150_V]  (value not drawn)
DS2  HSMH-C150  [AVAG-HSMX-C150_V]  (value not drawn)
DS3  HSMH-C150  [AVAG-HSMX-C150_V]  (value not drawn)
DS4  HSMH-C150  [AVAG-HSMX-C150_V]  (value not drawn)
Q1  BJT  [ONSC-SOT-23-3-318-08_V]
Q2  BJT  [ONSC-SOT-23-3-318-08_V]
R5  1K  [RESC2013X50X30NL20T20]
R6  464 Ohm  [RESC3216X70X50NL05T20]
R7  464 Ohm  [RESC3216X70X50NL05T20]
R8  10K  [RESC1609X50X30NL8T20]
R9  10K  [RESC1609X50X30NL8T20]
R10  10K  [RESC1609X50X30NL8T20]
R11  10K  [RESC1609X50X30NL8T20]
R12  1K  [RESC2013X50X30NL20T20]
R13  1K  [RESC2013X50X30NL20T20]
U6  XBP24CAUIT-001  [*MODULE_XBP24CAUIT-001]

### Ports
PA7 (in), PA9 (in), PA10 (in), PA11 (out), PA12 (in), PA15 (bidir), PB1 (in), PB10 (in), PB11 (out), PB13 (in), PB14 (bidir), PB15 (in)

### Nets
GND: 1.1(P$1) 1.11(P$11) 1.13(P$13) 1.22(P$22) 1.35(P$35) C12.1 C28.1 Q1.3(C) Q2.3(C) R10.2 R11.2 R12.1 R13.1 U6.10(GND)
V3.3: 1.27(P$27) C13.2 C27.2 DS1.1(A) DS2.1(A) R5.2 U6.1(VCC) U6.14(VREF)
Net1_2: 1.2(P$2) C13.1 C27.1
Net1_3: 1.3(P$3) ; port PA10
Net1_4: 1.4(P$4) R5.1 ; port PA9
Net1_6: 1.6(P$6) C28.2 ; port PB15
Net1_7: 1.7(P$7) ; port PB1
Net1_10: 1.10(P$10) ; port PB13
Net1_28: 1.28(P$28) DS3.1(A) R8.1
Net1_29: 1.29(P$29) ; port PB14
NetC12_2: C12.2 U6.5(~{RESET}) ; port PA7
NetDS1_2: DS1.2(K) R6.2
NetDS2_2: DS2.2(K) R7.2
NetDS3_2: DS3.2(K) R12.2
NetDS4_1: DS4.1(A) R9.1 U6.15(DIO5/ASSOC)
NetDS4_2: DS4.2(K) R13.2
NetQ1_1: Q1.1(B) R8.2 R10.1
NetQ1_2: Q1.2(E) R6.1
NetQ2_1: Q2.1(B) R9.2 R11.1
NetQ2_2: Q2.2(E) R7.1
NetU3_29: U6.3(DIN/!CONFIG) ; port PB10
NetU3_30: U6.2(DOUT) ; port PB11
NetU3_44: U6.6(PWM0/RSSI_PWM) ; port PA11
NetU3_45: U6.9(DI8/SLEEP_RQ/!DTR!) ; port PA12
NetU3_50: U6.16(DIO6/!RTS!) ; port PA15

Not connected (* = marked no-connect by the designer): 1 5(P$5) 8(P$8) 9(P$9) 12(P$12) 14(P$14) 15(P$15) 16(P$16) 17(P$17) 18(P$18) 19(P$19) 20(P$20) 21(P$21) 23(P$23) 24(P$24) 25(P$25) 26(P$26) 30(P$30) 31(P$31) 32(P$32) 33(P$33) 34(P$34) 36(P$36) 37(P$37); U6 4(SPI_MISO) 7(PWM1) 8(RESERVED) 11(DIO4/SPI_MOSI) 12(DIO7/!CTS!) 13(ON/!SLEEP) 17(DIO3/AD3/SPI_!SSEL) 18(DIO2/AD2/SPI_CLK) 19(DIO1/AD1/SPI_!ATTN) 20(DIO0/AD0)

### Library data of the parts
1 = XBEE_SMD_ADAPTER: GateName_1: G$1; SymbolName_1: XBEE_SMD_ADAPTER; LibraryName: UBCSolar; DeviceSetName: XBEE_SMD_ADAPTER; Package: XBEE_SMD_ADAPTER
C12 C28 = CMP-1037-03508-1: CAP 10nF 50V ±5% 1206 (3216 Metric) Thickness 1.7mm SMD; Tolerance: Â±5%; Case-EIA: 1206; Case-Metric: 3216; Technology: SMT; Rated Voltage: 50 V; Value: 10nF; Max Thickness: 1.7 mm
C13 = CMP-2000-04991-1: Chip Capacitor, 1 uF, +/- 10%, 25 V, -55 to 125 degC, 1206 (3216 Metric), RoHS, Tape and Reel; Manufacturer: Kemet; Temperature Coefficient / Code: +/-15%; Dielectric: X7R; Voltage Rating DC: 25V; Capacitance - nF: 1000nF; Class: Class1; Case Length: 3.2mm; Type: SMDMLCCX7R6.3-250VDCCommericalGrade; Case Width: 1.6mm; Product: GeneralTypeMLCCs; Capacitance: 1uF; Datasheet URL: https://ciiva.com/datasheet-click-18194173?src=ciiva&sig=6daff8c4; Operating Temperature Range: -55Cto+125C; Series: C1206C; RoHS: Details; Product Category: MultilayerCeramicCapacitorsMLCC-SMD/SMT; Manufacturer URL: http://www.kemet.com/; Minimum Operating Temperature: -55C; Dimensions: 1.6mmWx3.2mmLx1.6mmH; Termination Style: SMD/SMT; Brand: Kemet; Packaging: Reel; Package / Case: 1206(3216metric); Case Code - mm: 3216; Datasheet Version: Jul-14; Factory Pack Quantity: 2000; Package Description: 2-Pin Surface Mount Device, Body 3.2 x 1.6 mm; Tolerance: 10%; Package Reference: 1206; Case Height: 1.6mm; Case Code - in: 1206; Maximum Operating Temperature: +125C; Voltage Rating: 25V
C27 = CMP-2007-00223-1: Manufacturer: Kemet; Part Number: C0805C101J2GACTU
DS1-DS4 = CMP-2000-06426-1: LED Uni-Color Red, 65 mW, 25 mA, -40 to 85 degC, 2-Pin SMD, RoHS, Tape and Reel; Manufacturer: Avago; Product Height (mm): 1.1mm; Power Dissipation: 78W; Product Length (mm): 3.2mm; Forward Voltage: 2.6V; Luminous Intensity: 17mcd; DELETED: Compliant; Shape Type: Rectangular; Peak Wavelength: 660nm; Main Category: ChipLED; Dominant Wave Length: 639nm; Rad Hardened: No; Lens Type: ColorlessDiffused; Product Depth (mm): 1.6mm; Reverse Voltage: 5V; Forward Current: 25mA; Chip Material: GaAlAs; Test Current (It): 20mA; Viewing Angle: 170deg; Number of  Elements: 1; Type: Uni-Color; Package Reference: HSMX-C150; Package Description: 2-Pin Surface Mount Device, Body 3.2 x 1.6 mm; Operating Temp Range: -40Cto85C; Mounting: SurfaceMount; Emitting Color: Red; Pin Count: 2; Operating Temperature Classification: Industrial; Datasheet URL: http://media.digikey.com/pdf/Data%20Sheets/Avago%20PDFs/HSMz-Czzz.pdf; Package Type: ChipLed; Mounting Technology: SurfaceMount; High Brightness: No; Lens Dimensions: 2x1.6x0.6mm; Manufacturer URL: http://www.avagotech.com/; Lum Intensity: 17mcd; Datasheet Version: 03/2012; Packaging: TapeandReel
Q1 Q2 = CMP-1048-00631-1: General Purpose Transistor, NPN Silicon, 3-Pin SOT-23, Pb-Free, Tape and Reel; Manufacturer: On Semiconductor; PartNumber: MMBT3904LT1G; IC Continuous (A): 0.2; fT Min (MHz): 300; ComponentLink2Description: Datasheet; Polarity: NPN; PackageDescription: 3-Pin Small Outline Transistor, Body 2.92 x 1.3 mm, Pitch 0.95 mm; ComponentLink2URL: http://www.onsemi.cn/pub_link/Collateral/MMBT3904LT1-D.PDF; DatasheetVersion: Rev. 12; Mounting Technology: Surface Mount; ComponentLink1URL: http://www.onsemi.com/; ComponentLink3Description: Package Specification; ComponentLink1Description: Manufacturer URL; PackageVersion: Rev. AP, 11/2009; PackageReference: SOT-23-3-318-08; Packing: Tape and Reel; ComponentLink3URL: http://www.onsemi.cn/pub_link/Collateral/318-08.PDF; RoHS: TRUE
R5 R12 R13 = CMP-2001-03595-1: as R14 on sheet RF_STM
R6 R7 = CMP-2003-00383-1: Part Number: ERJ-8ENF4640V; Manufacturer: Panasonic
R8-R11 = CMP-1666-00005-4: Chip Resistor, 10 KOhm, +/- 1%, 100 mW, -55 to 155 degC, 0603 (1608 Metric), RoHS, Tape and Reel; Manufacturer: Vishay Semiconductor; Voltage Rating: 75 V; Max Operating Temperature: 155 degC; PackageDescription: 2-Pin Surface Mount Device, Body 1.575 x 0.85 mm; ComponentLink1Description: Manufacturer URL; RoHSCompliant: true; PackageReference: 0603; REACH SVHC: Unknown; Length: 1.55 mm; DatasheetVersion: 06/2012; Packaging: Tape and Reel; Min Operating Temperature: -55 degC; Mounting Technology: Surface Mount; ComponentLink2URL: https://datasheet.ciiva.com/11809/0900766b80d98afc-11809037.pdf; Height: 0.45 mm; ComponentLink2Description: Datasheet; Package Quantity: 5000; ComponentLink1URL: http://www.vishay.com/
U6 = XBP24CAUIT-001: 802.15.4 Transceiver Module 2.4GHz Antenna Not Included, U.FL Through Hole; MF: Digi International; SnapEDA_Link: https://www.snapeda.com/parts/XBP24CAUIT-001/Digi%20International/view-part/1219456/?ref=snap; Availability: Unavailable; Price: None; Package: Module Digi International; MP: XBP24CAUIT-001; Value: *

## Nets that join several sheets
5V: RF_STM (J1.4 U4.3), RF_Power (6 pins)
GND: RF_STM (29 pins), RF_Power (41 pins), RF_Xbee (14 pins)
V3.3: RF_STM (18 pins), RF_Power (C8.2 D1.2 L3.2 P6.1), RF_Xbee (8 pins)
Net1_3: RF_STM (U3.43), RF_Xbee (1.3)
Net1_4: RF_STM (U3.42), RF_Xbee (1.4 R5.1)
Net1_6: RF_STM (U3.36), RF_Xbee (1.6 C28.2)
Net1_7: RF_STM (U3.27), RF_Xbee (1.7)
Net1_10: RF_STM (U3.34), RF_Xbee (1.10)
Net1_29: RF_STM (U3.35), RF_Xbee (1.29)
NetC12_2: RF_STM (U3.23), RF_Xbee (C12.2 U6.5)
NetU3_29: RF_STM (U3.29), RF_Xbee (U6.3)
NetU3_30: RF_STM (U3.30), RF_Xbee (U6.2)
NetU3_44: RF_STM (U3.44), RF_Xbee (U6.6)
NetU3_45: RF_STM (U3.45), RF_Xbee (U6.9)
NetU3_50: RF_STM (U3.50), RF_Xbee (U6.16)